# Altium schematic sheet 07.SchDoc
size 297 x 209 mm
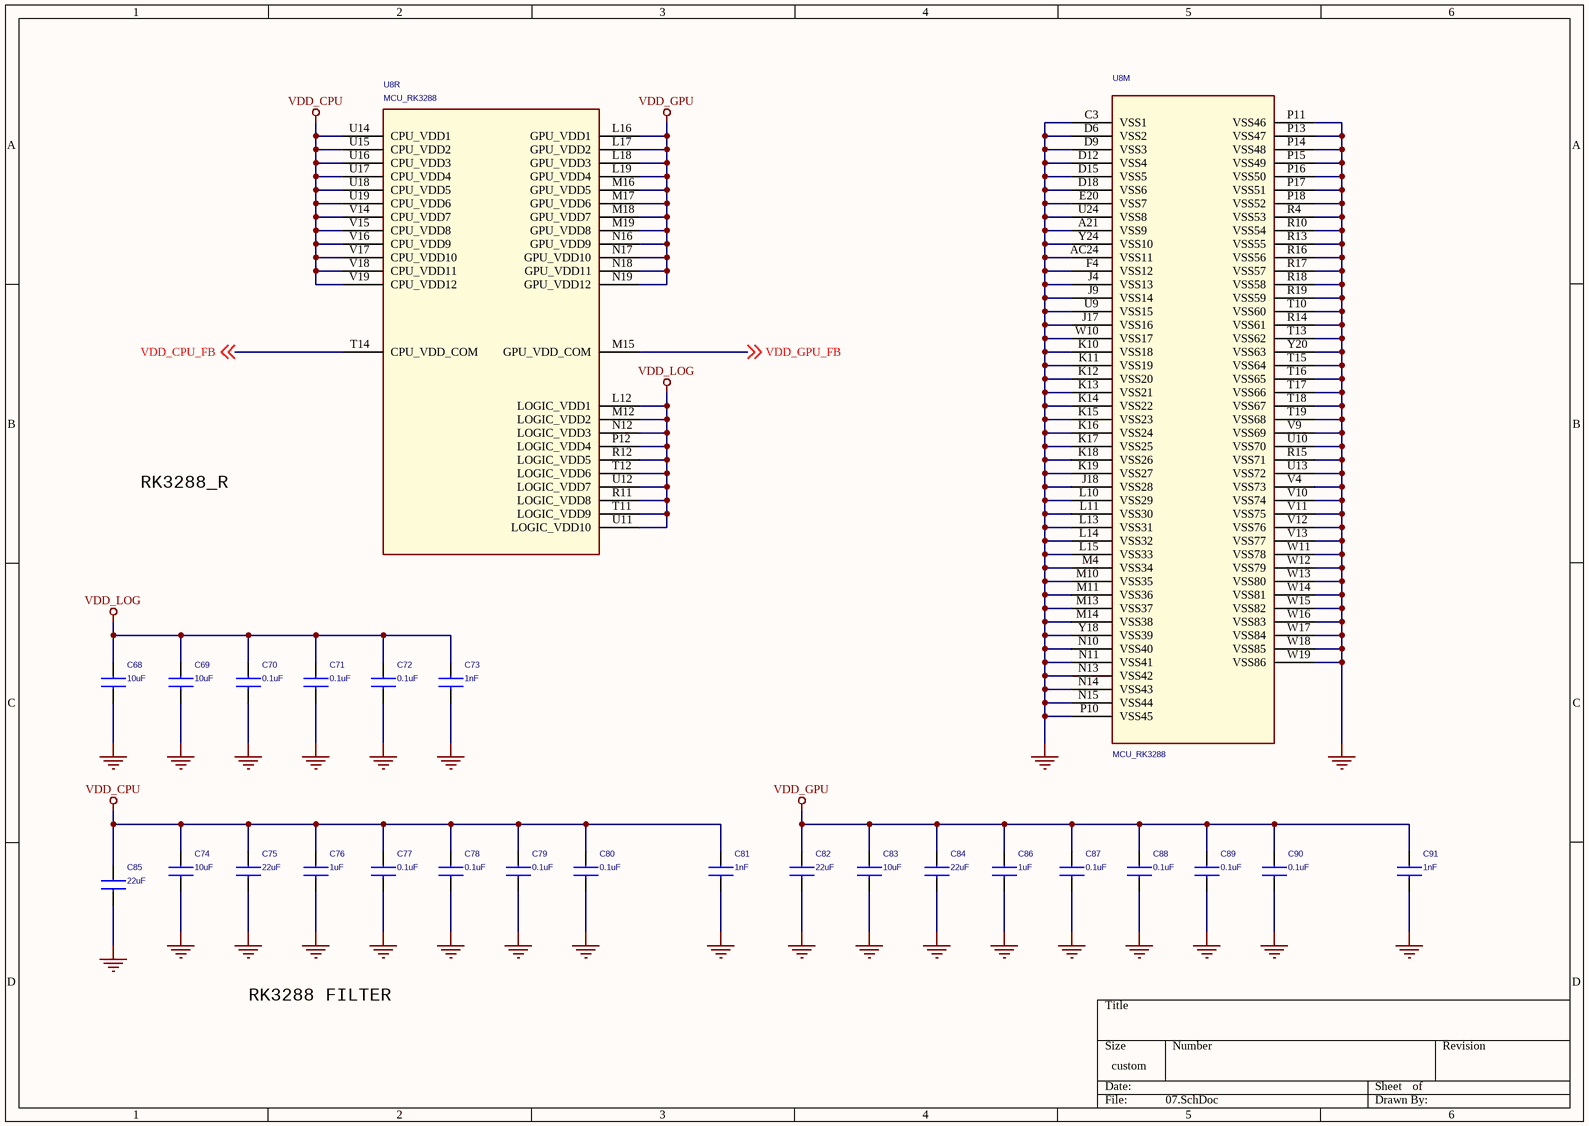
[diagram p0: 07.SchDoc]

## Parts
C68  10uF  [C0603]
C69  10uF  [C0603]
C70  0.1uF  [C0603]
C71  0.1uF  [C0603]
C72  0.1uF  [C0603]
C73  1nF  [C0603]
C74  10uF  [C0603]
C75  22uF  [C0603]
C76  1uF  [C0603]
C77  0.1uF  [C0603]
C78  0.1uF  [C0603]
C79  0.1uF  [C0603]
C80  0.1uF  [C0603]
C81  1nF  [C0603]
C82  22uF  [C0603]
C83  10uF  [C0603]
C84  22uF  [C0603]
C85  22uF  [C0603]
C86  1uF  [C0603]
C87  0.1uF  [C0603]
C88  0.1uF  [C0603]
C89  0.1uF  [C0603]
C90  0.1uF  [C0603]
C91  1nF  [C0603]
U8  MCU_RK3288  [BGA453-19X19]  (parts M,R of 24)

## Nets
GND: C68.1 C69.2 C70.2 C71.2 C72.2 C73.2 C74.1 C75.1 C76.2 C77.2 C78.2 C79.2 C80.2 C81.2 C82.1 C83.1 C84.1 C85.2 C86.2 C87.2 C88.2 C89.2 C90.2 C91.2 U8.A21(VSS9) U8.AC24(VSS11) U8.C3(VSS1) U8.D6(VSS2) U8.D9(VSS3) U8.D12(VSS4) U8.D15(VSS5) U8.D18(VSS6) U8.E20(VSS7) U8.F4(VSS12) U8.J4(VSS13) U8.J9(VSS14) U8.J17(VSS16) U8.J18(VSS28) U8.K10(VSS18) U8.K11(VSS19) U8.K12(VSS20) U8.K13(VSS21) U8.K14(VSS22) U8.K15(VSS23) U8.K16(VSS24) U8.K17(VSS25) U8.K18(VSS26) U8.K19(VSS27) U8.L10(VSS29) U8.L11(VSS30) U8.L13(VSS31) U8.L14(VSS32) U8.L15(VSS33) U8.M4(VSS34) U8.M10(VSS35) U8.M11(VSS36) U8.M13(VSS37) U8.M14(VSS38) U8.N10(VSS40) U8.N11(VSS41) U8.N13(VSS42) U8.N14(VSS43) U8.N15(VSS44) U8.P10(VSS45) U8.P11(VSS46) U8.P13(VSS47) U8.P14(VSS48) U8.P15(VSS49) U8.P16(VSS50) U8.P17(VSS51) U8.P18(VSS52) U8.R4(VSS53) U8.R10(VSS54) U8.R13(VSS55) U8.R14(VSS61) U8.R15(VSS71) U8.R16(VSS56) U8.R17(VSS57) U8.R18(VSS58) U8.R19(VSS59) U8.T10(VSS60) U8.T13(VSS62) U8.T15(VSS64) U8.T16(VSS65) U8.T17(VSS66) U8.T18(VSS67) U8.T19(VSS68) U8.U9(VSS15) U8.U10(VSS70) U8.U13(VSS72) U8.U24(VSS8) U8.V4(VSS73) U8.V9(VSS69) U8.V10(VSS74) U8.V11(VSS75) U8.V12(VSS76) U8.V13(VSS77) U8.W10(VSS17) U8.W11(VSS78) U8.W12(VSS79) U8.W13(VSS80) U8.W14(VSS81) U8.W15(VSS82) U8.W16(VSS83) U8.W17(VSS84) U8.W18(VSS85) U8.W19(VSS86) U8.Y18(VSS39) U8.Y20(VSS63) U8.Y24(VSS10)
VDD_CPU: C74.2 C75.2 C76.1 C77.1 C78.1 C79.1 C80.1 C81.1 C85.1 U8.U14(CPU_VDD1) U8.U15(CPU_VDD2) U8.U16(CPU_VDD3) U8.U17(CPU_VDD4) U8.U18(CPU_VDD5) U8.U19(CPU_VDD6) U8.V14(CPU_VDD7) U8.V15(CPU_VDD8) U8.V16(CPU_VDD9) U8.V17(CPU_VDD10) U8.V18(CPU_VDD11) U8.V19(CPU_VDD12)
VDD_GPU: C82.2 C83.2 C84.2 C86.1 C87.1 C88.1 C89.1 C90.1 C91.1 U8.L16(GPU_VDD1) U8.L17(GPU_VDD2) U8.L18(GPU_VDD3) U8.L19(GPU_VDD4) U8.M16(GPU_VDD5) U8.M17(GPU_VDD6) U8.M18(GPU_VDD7) U8.M19(GPU_VDD8) U8.N16(GPU_VDD9) U8.N17(GPU_VDD10) U8.N18(GPU_VDD11) U8.N19(GPU_VDD12)
VDD_LOG: C68.2 C69.1 C70.1 C71.1 C72.1 C73.1 U8.L12(LOGIC_VDD1) U8.M12(LOGIC_VDD2) U8.N12(LOGIC_VDD3) U8.P12(LOGIC_VDD4) U8.R11(LOGIC_VDD8) U8.R12(LOGIC_VDD5) U8.T11(LOGIC_VDD9) U8.T12(LOGIC_VDD6) U8.U11(LOGIC_VDD10) U8.U12(LOGIC_VDD7)
VDD_CPU_FB: U8.T14(CPU_VDD_COM) ; off-sheet VDD_CPU_FB
VDD_GPU_FB: U8.M15(GPU_VDD_COM) ; off-sheet VDD_GPU_FB

## Notes on the sheet
- RK3288_R
- RK3288 FILTER

## Library data of the parts
C68 C83 = CAP NP_Dup3: CAP,MLCC,10uF,+/-10%,X5R,6.3V,SMD0805
C69-C82 C84 C86-C91 = CAP NP_Dup3
C85 = CAP NP_Dup3: CAP,MLCC,47uF,+/-10%,X5R,4V,SMD1210
U8 = MCU_RK3288_3